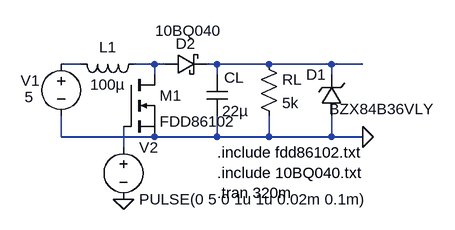
[diagram p0: schematic 3.4.1.asc]
3.4.1.asc, the LTspice schematic file:
Version 4
SHEET 1 880 736
WIRE 144 512 112 512
WIRE 256 512 224 512
WIRE 272 512 256 512
WIRE 352 512 336 512
WIRE 432 512 352 512
WIRE 528 512 432 512
WIRE 576 512 528 512
WIRE 256 528 256 512
WIRE 352 528 352 512
WIRE 528 528 528 512
WIRE 112 624 112 592
WIRE 256 624 112 624
WIRE 352 624 352 592
WIRE 352 624 256 624
WIRE 432 624 432 592
WIRE 432 624 352 624
WIRE 528 624 528 592
WIRE 528 624 432 624
WIRE 576 624 528 624
WIRE 208 640 208 608
FLAG 208 720 0
FLAG 576 624 0
SYMBOL Cap 336 528 R0
WINDOW 0 27 5 Left 2
SYMATTR InstName CL
SYMATTR Value 22µ
SYMBOL Res 416 496 R0
SYMATTR InstName RL
SYMATTR Value 5k
SYMBOL zener 544 592 R180
WINDOW 0 24 64 Left 2
WINDOW 3 -142 11 Left 2
SYMATTR InstName D1
SYMATTR Value BZX84B36VLY
SYMATTR Description Diode
SYMATTR Type diode
SYMBOL schottky 272 528 R270
WINDOW 0 32 32 VTop 2
WINDOW 3 83 36 VBottom 2
SYMATTR InstName D2
SYMATTR Value 10BQ040
SYMATTR Description Diode
SYMATTR Type diode
SYMBOL Voltage 112 496 R0
WINDOW 0 -62 41 Left 2
WINDOW 3 -56 67 Left 2
SYMATTR InstName V1
SYMATTR Value 5
SYMBOL ind 240 496 R90
WINDOW 0 5 56 VBottom 2
WINDOW 3 32 56 VTop 2
SYMATTR InstName L1
SYMATTR Value 100µ
SYMATTR SpiceLine Rser=10
SYMBOL nmos 208 528 R0
SYMATTR InstName M1
SYMATTR Value FDD86102
SYMATTR Prefix X
SYMBOL Voltage 208 624 R0
SYMATTR InstName V2
SYMATTR Value PULSE(0 5 0 1u 1u 0.02m 0.1m)
TEXT 352 648 Left 2 !.include fdd86102.txt\n.include 10BQ040.txt\n.tran 320m

The netlist it stands for:
* 3.4.1.asc
CL N003 0 22µ
RL N003 0 5k
D1 0 N003 BZX84B36VLY
D2 N002 N003 10BQ040
V1 N001 0 5
L1 N002 N001 100µ Rser=10
XM1 N002 N004 0 FDD86102  ; pins D G S
V2 N004 0 PULSE(0 5 0 1u 1u 0.02m 0.1m)
.model D D
.lib standard.dio
.include fdd86102.txt
.include 10BQ040.txt
.tran 320m
.backanno
.end